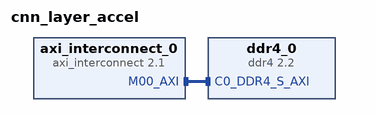
[diagram p0: block diagram of the top level]
# Vivado block design cnn_layer_accel, xcvu37p-fsvh2892-2-e, Vivado 2019.1
create_bd_design cnn_layer_accel

create_bd_cell -type ip -vlnv xilinx.com:ip:ddr4:2.2 ddr4_0
set_property -dict [list \
  CONFIG.C0.DDR4_AxiAddressWidth 32 \
  CONFIG.C0.DDR4_AxiDataWidth 512 \
  CONFIG.C0.DDR4_DataMask NO_DM_NO_DBI \
  CONFIG.C0.DDR4_DataWidth 72 \
] [get_bd_cells ddr4_0]
create_bd_cell -type ip -vlnv xilinx.com:ip:axi_interconnect:2.1 axi_interconnect_0
set_property -dict {CONFIG.NUM_MI 1 CONFIG.NUM_SI 6} [get_bd_cells axi_interconnect_0]

# ---- connections ----

connect_bd_intf_net [get_bd_intf_pins axi_interconnect_0/M00_AXI] [get_bd_intf_pins ddr4_0/C0_DDR4_S_AXI]

validate_bd_design
save_bd_design
